# Altium schematic sheet S7_Audio_IMU_uSD.SchDoc
size A3
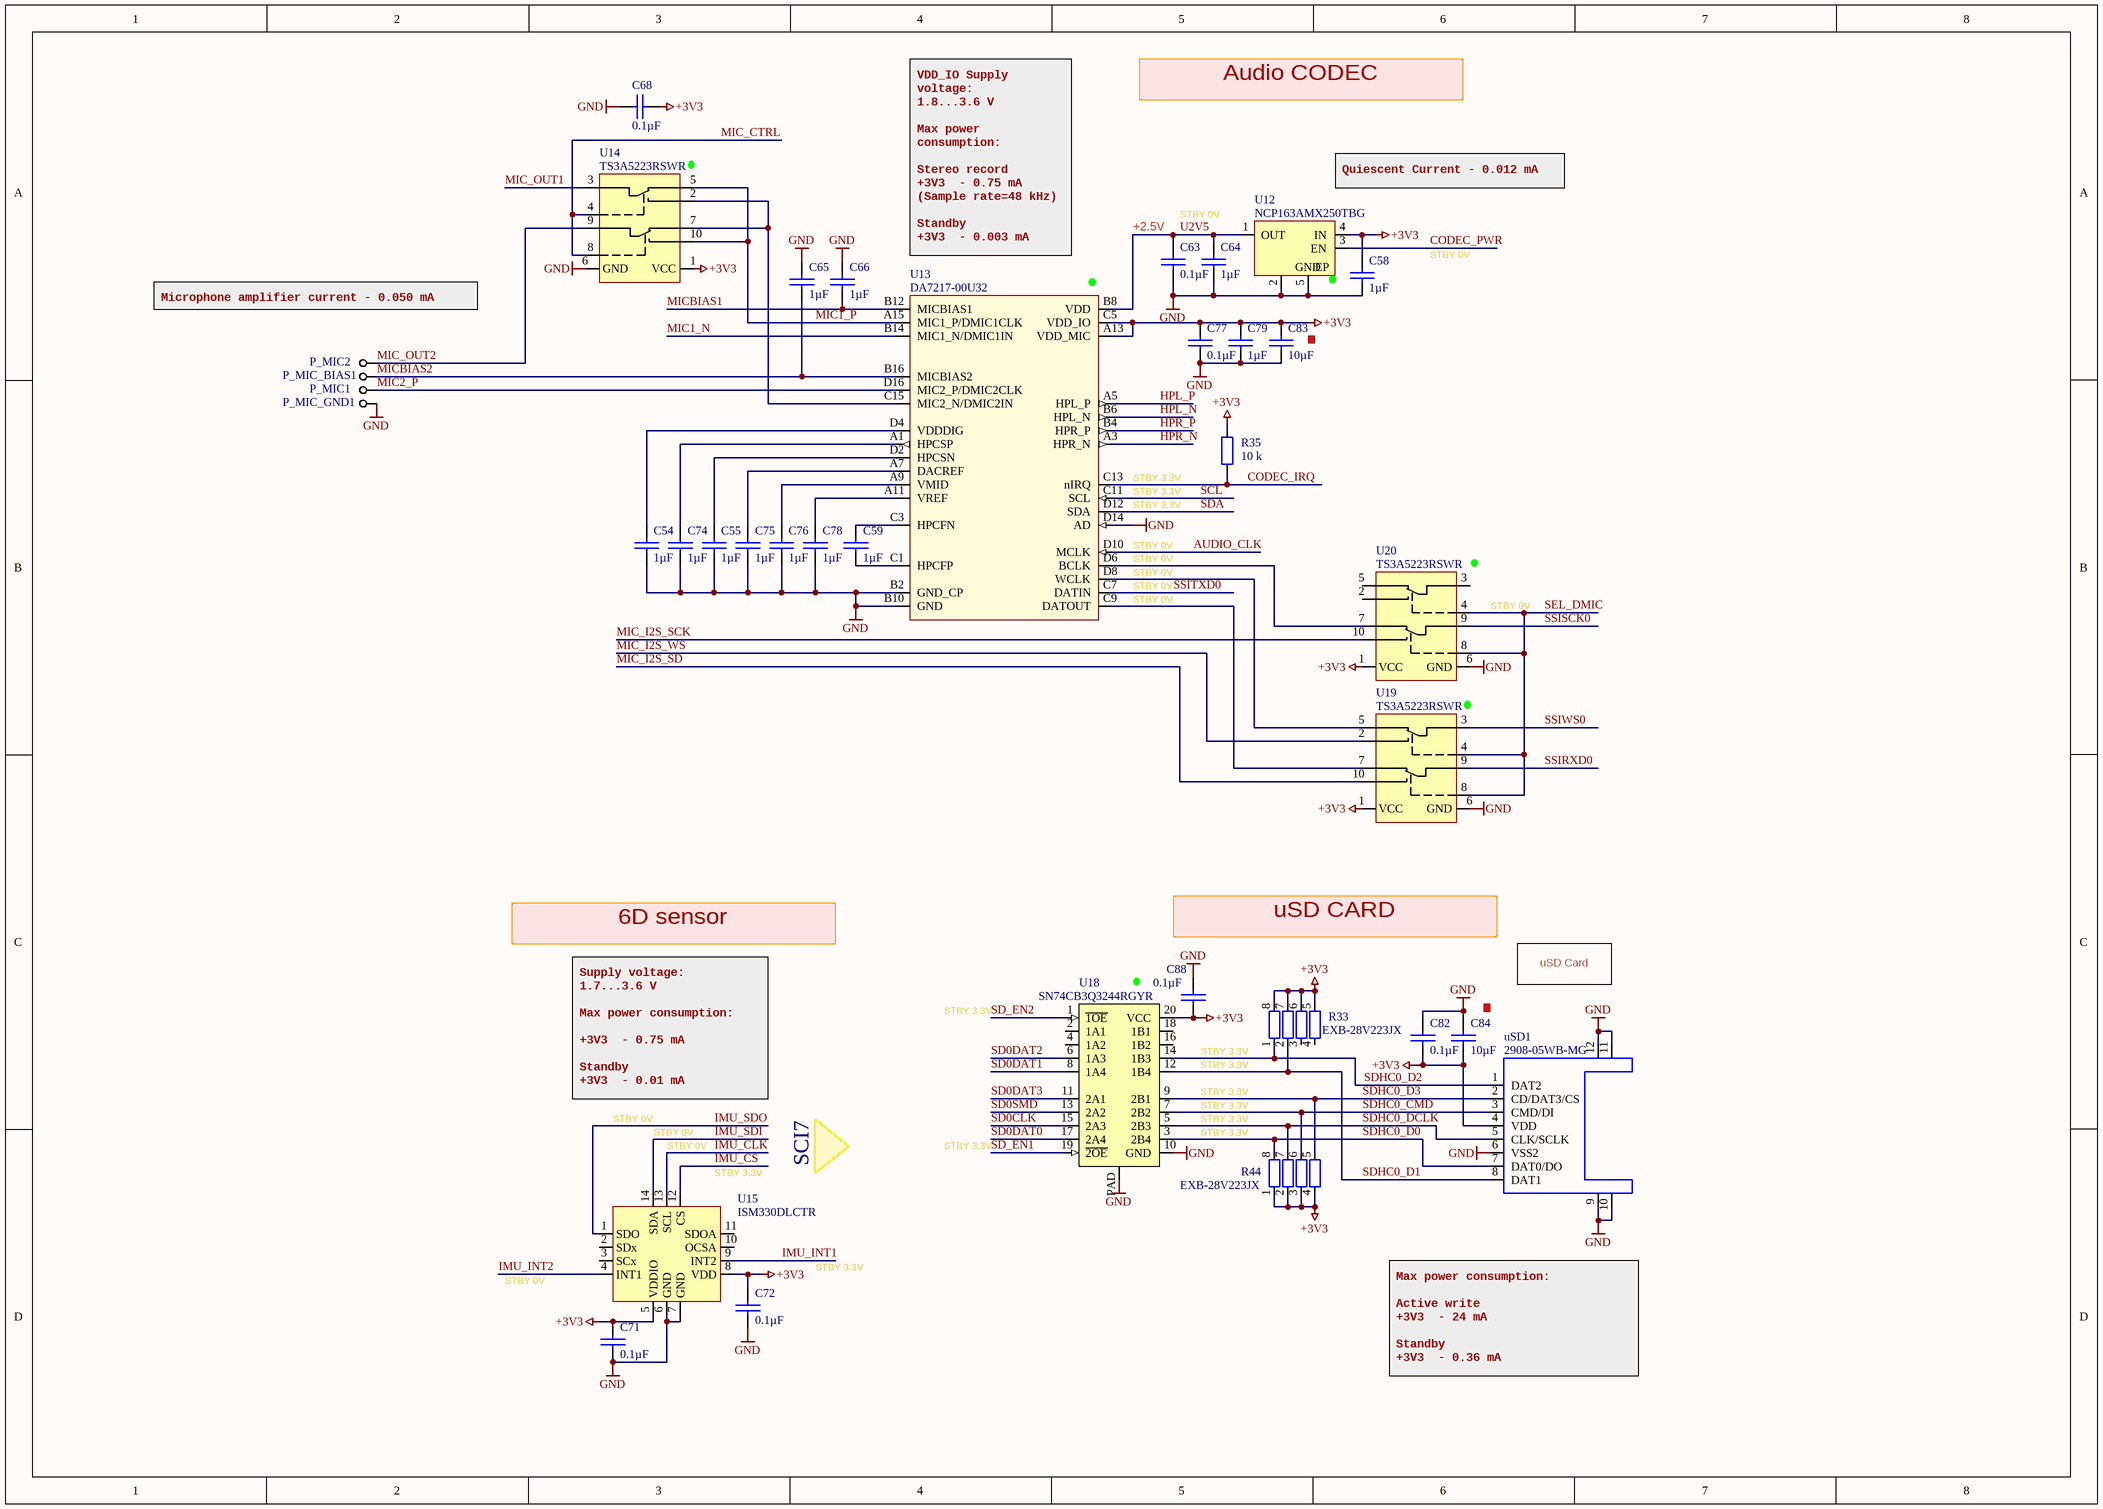
[diagram p0: S7_Audio_IMU_uSD.SchDoc]

## Parts
C54  value 1µF  [0402 CAP]  (hidden comment: Capacitor)
C55  value 1µF  [0402 CAP]  (hidden comment: Capacitor)
C58  value 1µF  [0402 CAP]  (hidden comment: Capacitor)
C59  value 1µF  [0402 CAP]  (hidden comment: Capacitor)
C63  value 0.1µF  [0402 CAP]  (hidden comment: Capacitor)
C64  value 1µF  [0402 CAP]  (hidden comment: Capacitor)
C65  value 1µF  [0402 CAP]  (hidden comment: Capacitor)
C66  value 1µF  [0402 CAP]  (hidden comment: Capacitor)
C68  value 0.1µF  [0402 CAP]  (hidden comment: Capacitor)
C71  value 0.1µF  [0402 CAP]  (hidden comment: Capacitor)
C72  value 0.1µF  [0402 CAP]  (hidden comment: Capacitor)
C74  value 1µF  [0402 CAP]  (hidden comment: Capacitor)
C75  value 1µF  [0402 CAP]  (hidden comment: Capacitor)
C76  value 1µF  [0402 CAP]  (hidden comment: Capacitor)
C77  value 0.1µF  [0402 CAP]  (hidden comment: Capacitor)
C78  value 1µF  [0402 CAP]  (hidden comment: Capacitor)
C79  value 1µF  [0402 CAP]  (hidden comment: Capacitor)
C82  value 0.1µF  [0402 CAP]  (hidden comment: Capacitor)
C83  value 10µF  [0603 CAP]  (hidden comment: Capacitor)
C84  value 10µF  [0603 CAP]  (hidden comment: Capacitor)
C88  value 0.1µF  [0402 CAP]  (hidden comment: Capacitor)
P_MIC1  PIN_TOP_1.5x2  [PIN_TOP_1.5x2]  (value not drawn)  (net tie, no BOM)
P_MIC2  PIN_TOP_1.5x2  [PIN_TOP_1.5x2]  (value not drawn)  (net tie, no BOM)
P_MIC_BIAS1  PIN_TOP_1.5x2  [PIN_TOP_1.5x2]  (value not drawn)  (net tie, no BOM)
P_MIC_GND1  PIN_TOP_1.5x2  [PIN_TOP_1.5x2]  (value not drawn)  (net tie, no BOM)
R33  EXB-28V223JX  [EXB28V 2x1 mm]
R35  value 10 k  [0402]  (hidden comment: Resistor)
R44  EXB-28V223JX  [EXB28V 2x1 mm]
U12  NCP163AMX250TBG  [4-XDFN]
U13  DA7217-00U32  [Dilaog 34-WLCSP (4.57x1.98)]
U14  TS3A5223RSWR  [uQFN-10]
U15  ISM330DLCTR  [LGA-14 BOSCH]
U18  SN74CB3Q3244RGYR  [TI_PVQFN-N20]
U19  TS3A5223RSWR  [uQFN-10]
U20  TS3A5223RSWR  [uQFN-10]
uSD1  2908-05WB-MG  [2908-05WB-MG]

## Nets
+3V3: C58.1 C68.2 C71.1 C72.1 C77.1 C79.1 C82.2 C83.1 C84.2 C88.2 R33.5 R33.6 R33.7 R33.8 R35.2 R44.1 R44.2 R44.3 R44.4 U12.4(IN) U13.A13(VDD_MIC) U13.C5(VDD_IO) U14.1(VCC) U15.5(VDDIO) U15.8(VDD) U18.20(VCC) U19.1(VCC) U20.1(VCC) uSD1.4(VDD)
GND: C54.2 C55.2 C58.2 C63.2 C64.2 C65.1 C66.1 C68.1 C71.2 C72.2 C74.2 C75.2 C76.2 C77.2 C78.2 C79.2 C82.1 C83.2 C84.1 C88.1 P_MIC_GND1.1 U12.2(GND) U12.5(EP) U13.B2(GND_CP) U13.B10(GND) U13.D14(AD) U14.6(GND) U15.6(GND) U15.7(GND) U18.10(GND) U18.PAD U19.6(GND) U20.6(GND) uSD1.6(VSS2) uSD1.9 uSD1.10(WP) uSD1.11(GND) uSD1.12(GND)
AUDIO_CLK: U13.D10(MCLK)
CODEC_IRQ: R35.1 U13.C13(nIRQ)
CODEC_PWR: U12.3(EN)
HPL_N: U13.B6(HPL_N)
HPL_P: U13.A5(HPL_P)
HPR_N: U13.A3(HPR_N)
HPR_P: U13.B4(HPR_P)
IMU_CLK: U15.13(SCL)
IMU_CS: U15.12(CS)
IMU_INT1: U15.9(INT2)
IMU_INT2: U15.4(INT1)
IMU_SDI: U15.14(SDA)
IMU_SDO: U15.1(SDO)
MIC1_N: U13.B14(MIC1_N/DMIC1IN)
MIC1_P: U13.A15(MIC1_P/DMIC1CLK) U14.5(NC1) U14.10(NO2)
MIC2_P: P_MIC1.1 U13.D16(MIC2_P/DMIC2CLK)
MIC_CTRL: U14.4(SEL1) U14.8(SEL2)
MIC_I2S_SCK: U20.10(NO2)
MIC_I2S_SD: U19.10(NO2)
MIC_I2S_WS: U19.2(NO1)
MIC_OUT1: U14.3(COM1)
MIC_OUT2: P_MIC2.1 U14.9(COM2)
MICBIAS1: C66.2 U13.B12(MICBIAS1)
MICBIAS2: C65.2 P_MIC_BIAS1.1 U13.B16(MICBIAS2)
SCL: U13.C11(SCL)
SD0CLK: U18.15(2A3)
SD0DAT0: U18.17(2A4)
SD0DAT1: U18.8(1A4)
SD0DAT2: U18.6(1A3)
SD0DAT3: U18.11(2A1)
SD0SMD: U18.13(2A2)
SD_EN1: U18.19(~{2OE})
SD_EN2: U18.1(~{1OE})
SDA: U13.D12(SDA)
SDHC0_CMD: R44.6 U18.7(2B2) uSD1.3(CMD/DI)
SDHC0_D0: R44.8 U18.3(2B4) uSD1.7(DAT0/DO)
SDHC0_D1: R33.2 U18.12(1B4) uSD1.8(DAT1)
SDHC0_D2: R33.1 U18.14(1B3) uSD1.1(DAT2)
SDHC0_D3: R44.5 U18.9(2B1) uSD1.2(CD/DAT3/CS)
SDHC0_DCLK: R44.7 U18.5(2B3) uSD1.5(CLK/SCLK)
SEL_DMIC: U19.4(SEL1) U19.8(SEL2) U20.4(SEL1) U20.8(SEL2)
SSIRXD0: U19.9(COM2)
SSISCK0: U20.9(COM2)
SSITXD0: U13.C7(DATIN)
SSIWS0: U19.3(COM1)
U2V5: C63.1 C64.1 U12.1(OUT) U13.B8(VDD)
NetC54_1: C54.1 U13.D4(VDDDIG)
NetC55_1: C55.1 U13.D2(HPCSN)
NetC59_1: C59.1 U13.C3(HPCFN)
NetC59_2: C59.2 U13.C1(HPCFP)
NetC74_1: C74.1 U13.A1(HPCSP)
NetC75_1: C75.1 U13.A7(DACREF)
NetC76_1: C76.1 U13.A9(VMID)
NetC78_1: C78.1 U13.A11(VREF)
NetU13_C9: U13.C9(DATOUT) U19.7(NC2)
NetU13_C15: U13.C15(MIC2_N/DMIC2IN) U14.2(NO1) U14.7(NC2)
NetU13_D6: U13.D6(BCLK) U20.7(NC2)
NetU13_D8: U13.D8(WCLK) U19.5(NC1)

Not connected (* = marked no-connect by the designer): R33 3 4; U15 2(SDx) 3(SCx) 10(OCSA) 11(SDOA); U18 2(1A1) 4(1A2) 16(1B2) 18(1B1); U20 2(NO1) 3(COM1) 5(NC1)

## Notes on the sheet
- Audio CODEC
- (near U12) Quiescent Current - 0.012 mA
- (near C63) +2.5V
- STBY 0V
- Microphone amplifier current - 0.050 mA
- VDD_IO Supply voltage:
  1.8...3.6 V
  Max power consumption:
  Stereo record
  +3V3  - 0.75 mA (Sample rate=48 kHz)
  Standby
  +3V3  - 0.003 mA
- (near U13) STBY 3.3V
- STBY 3.3V
- (near U13) STBY 0V
- (near U20) STBY 0V
- 6D sensor
- uSD CARD
- uSD Card
- Supply voltage:
  1.7...3.6 V
  Max power consumption:
  +3V3  - 0.75 mA
  Standby
  +3V3  - 0.01 mA
- (near U15) STBY 3.3V
- SCI7
- Max power consumption:
  Active write
  +3V3  - 24 mA
  Standby
  +3V3  - 0.36 mA

## Library data of the parts
C54 C55 C58 C59 C64-C66 C74-C76 C78 C79 = TMK105BJ105MV-F: 1µF, ±20%, 25V, X5R, 0402 (1005 Metric), -55°C ~ 85°C, -, General Purpose; Manufacturer: Taiyo Yuden; PartNum: 587-3245-1-ND; Voltage - Rated: 25V; Part Number: TMK105BJ105MV-F; Distributor: Digi-Key; PartName: TMK105BJ105MV-F; Price: 0.22000; Tolerance: ±20%; Temperature Coefficient: X5R; Operating Temperature: -55°C ~ 85°C; Features: -; Package / Case: 0402 (1005 Metric)
C63 C68 C71 C72 C77 C82 C88 = 0402B104K500CT: 0.1µF, ±10%, 50V, X7R, 0402 (1005 Metric), -55°C ~ 125°C, -, General Purpose; Manufacturer: Walsin Technology Corporation; PartNum: 1292-1176-1-ND; Voltage - Rated: 50V; Part Number: 0402B104K500CT; Distributor: Digi-Key; PartName: 0402B104K500CT; Price: 0.19000; Tolerance: ±10%; Temperature Coefficient: X7R; Operating Temperature: -55°C ~ 125°C; Features: -; Package / Case: 0402 (1005 Metric)
C83 C84 = GRT188R61C106KE13D: 10µF, ±10%, 16V, X5R, 0603 (1608 Metric), -55°C ~ 85°C, -, Automotive; Manufacturer: Murata Electronics North America; PartNum: 490-12317-1-ND; Voltage - Rated: 16V; Part Number: GRT188R61C106KE13D; Distributor: Digi-Key; PartName: GRT188R61C106KE13D; Price: 0.22770; Tolerance: ±10%; Temperature Coefficient: X5R; Operating Temperature: -55°C ~ 85°C; Features: -; Package / Case: 0603 (1608 Metric)
P_MIC1 P_MIC2 P_MIC_BIAS1 P_MIC_GND1 = PIN_TOP_1.5x2: Pin on TOP layer 1.5 x 2 mm
R33 R44 = EXB-28V223JX: 22k Ohm ±5%,  4 Resistor, -55°C ~ 125°C,(2.00mm x 1.00mm); Manufacturer: Panasonic Electronic Components; PartNum: Y7223CT-ND; Distributor: Digi-Key; Price: 0.1$; Tolerance: 5%; Value: 22 k; PartName: EXB-28V223JX
R35 = RMCF0402FT10K0: 10 kOhms, ±1%, 0.063W, 1/16W, Thick Film, ±100ppm/°C, 0402 (1005 Metric), -55°C ~ 155°C, Automotive AEC-Q200; Manufacturer: Stackpole Electronics Inc; PartNum: RMCF0402FT10K0CT-ND; Voltage: 75V; Distributor: Digi-Key; Price: 0.10000; Tolerance: ±1%; PartName: RMCF0402FT10K0; Part Number: RMCF0402FT10K0; Temperature Coefficient: ±100ppm/°C; Operating Temperature: -55°C ~ 155°C; Power (Watts): 0.063W, 1/16W; Features: Automotive AEC-Q200; Package / Case: 0402 (1005 Metric)
U12 = NCP163AMX250TBG: LDO 2.5V, 250 mA, Vin < 5.5V, Iq < 20uA, -40..+125 C,  4-XDFN (1x1); Manufacturer: ON Semiconductor; PartNum: NCP163AMX250TBGOSCT-ND; Price: 0.41$; Distributor: Digi-Key; PartName: NCP163AMX250TBG
U13 = DA7217-00U32: Low power CODEC, 24 b, 2/2, I²C, I²S,  1.5V ~ 3.6V,  -25°C ~ 85°C, 34-WLCSP (4.57x1.98); Manufacturer: Dialog Semiconductor GmbH; PartNum: 1564-1043-1-ND; Price: 2.38$; Distributor: Digi-Key; PartName: DA7217-00U32
U14 U19 U20 = TS3A5223RSWR: 2 Circuit IC Switch 2:1 600 mOhm,-40°C ~ 85°C, 10-UQFN (1.8x1.4); Manufacturer: Texas Instruments; PartNum: 296-35687-1-ND; Distributor: Digi-Key; PartName: TS3A5223RSWR
U15 = ISM330DLCTR: Accelerometer, Gyroscope, Temperature, 3 Axis Sensor I²C, SPI , -40°C ~ 85°C, 14-LGA (2.5x3); Manufacturer: STMicroelectronics; PartNum: 497-17583-1-ND; Price: 6.28$; Distributor: Digi-Key; PartName: ISM330DLCTR
U18 = SN74CB3Q3244RGYR: Bus Switch 4 x 1:1, 2.3V ~ 3.6V,  -40°C ~ 85°C, 20-VQFN (3.5x4.5); Manufacturer: Texas Instruments; PartNum: 296-19127-1-ND; Distributor: Digi-Key; PartName: SN74CB3Q3244RGYR; Price: 1.08$
uSD1 = 2908-05WB-MG: microSD cadr holder; Manufacturer: Amphenol Commercial Products; PartNum: 101-00660-68-6-1-ND; PartName: 101-00660-68-6; Price: 1.97$; Distributor: Digi-Key